# Altium schematic sheet bbr18_pc_battery_connection_board.SchDoc
size A4
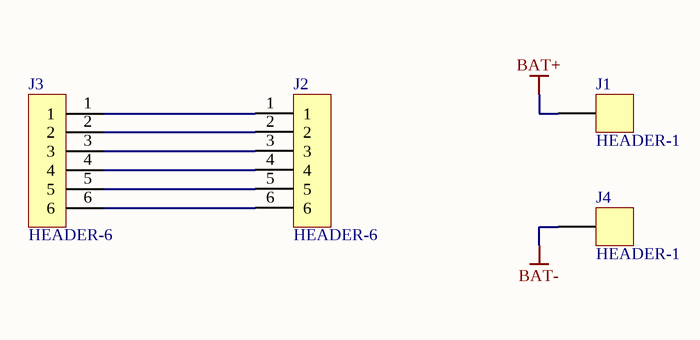
[diagram p0: bbr18_pc_battery_connection_board.SchDoc]

## Parts
J1  HEADER-1  [2MM-BANANA-VIA]
J2  HEADER-6  [MICRO-MATCH-FOB-06]
J3  HEADER-6  [MICRO-MATCH-FOB-06]
J4  HEADER-1  [2MM-BANANA-VIA]

## Nets
BAT+: J1.1
BAT-: J4.1
NetJ2_1: J2.1 J3.1
NetJ2_2: J2.2 J3.2
NetJ2_3: J2.3 J3.3
NetJ2_4: J2.4 J3.4
NetJ2_5: J2.5 J3.5
NetJ2_6: J2.6 J3.6